# Altium schematic sheet SenLEDFet.SchDoc
size A4
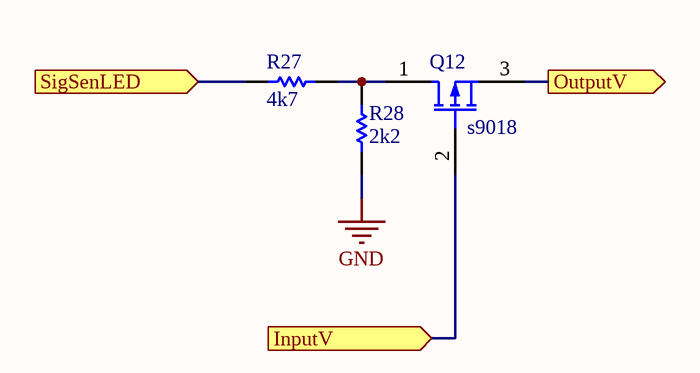
[diagram p0: SenLEDFet.SchDoc]

## Parts
Q12  s9018  [SOT-23_N]
R27  value 4k7  [6-0805_L]  (hidden comment: R4k7)
R28  value 2k2  [6-0805_L]  (hidden comment: R2k2)

## Ports
InputV (in), OutputV (out), SigSenLED (in)

## Nets
GND: R28.2
InputV: Q12.2(G) ; port InputV
OutputV: Q12.3(S) ; port OutputV
SigSenLED: R27.2 ; port SigSenLED
NetQ12_1: Q12.1(D) R27.1 R28.1

## Notes on the sheet
- Title
- Size:
- Date:
- A4
- Number:
- Time:
- Revision:
- Sheet
- of
- File:

## Library data of the parts
Q12 = MOSFET-P: P-Channel MOSFET; Published: 8-Jun-2000; LatestRevisionDate: 17-Jul-2002; LatestRevisionNote: Re-released for DXP Platform.; PackageVersion: 1995/1996; PackageReference: E3; Publisher: Altium Limited; PackageDescription: TO, Flat Index; 3 In-Line, Axial Leads; Body Dia. 4.6mm; Lead Dia. 0.5 mm (max)
R27 R28 = Res1: Resistor; Published: 8-Jun-2000; LatestRevisionDate: 17-Jul-2002; LatestRevisionNote: Re-released for DXP Platform.; PackageReference: AXIAL-0.3; Publisher: Altium Limited; PackageDescription: Axial Device, Thru-Hole; 2 Leads; 0.3 in Pin Spacing